# EAGLE design Circuit (EAGLE 5.00)
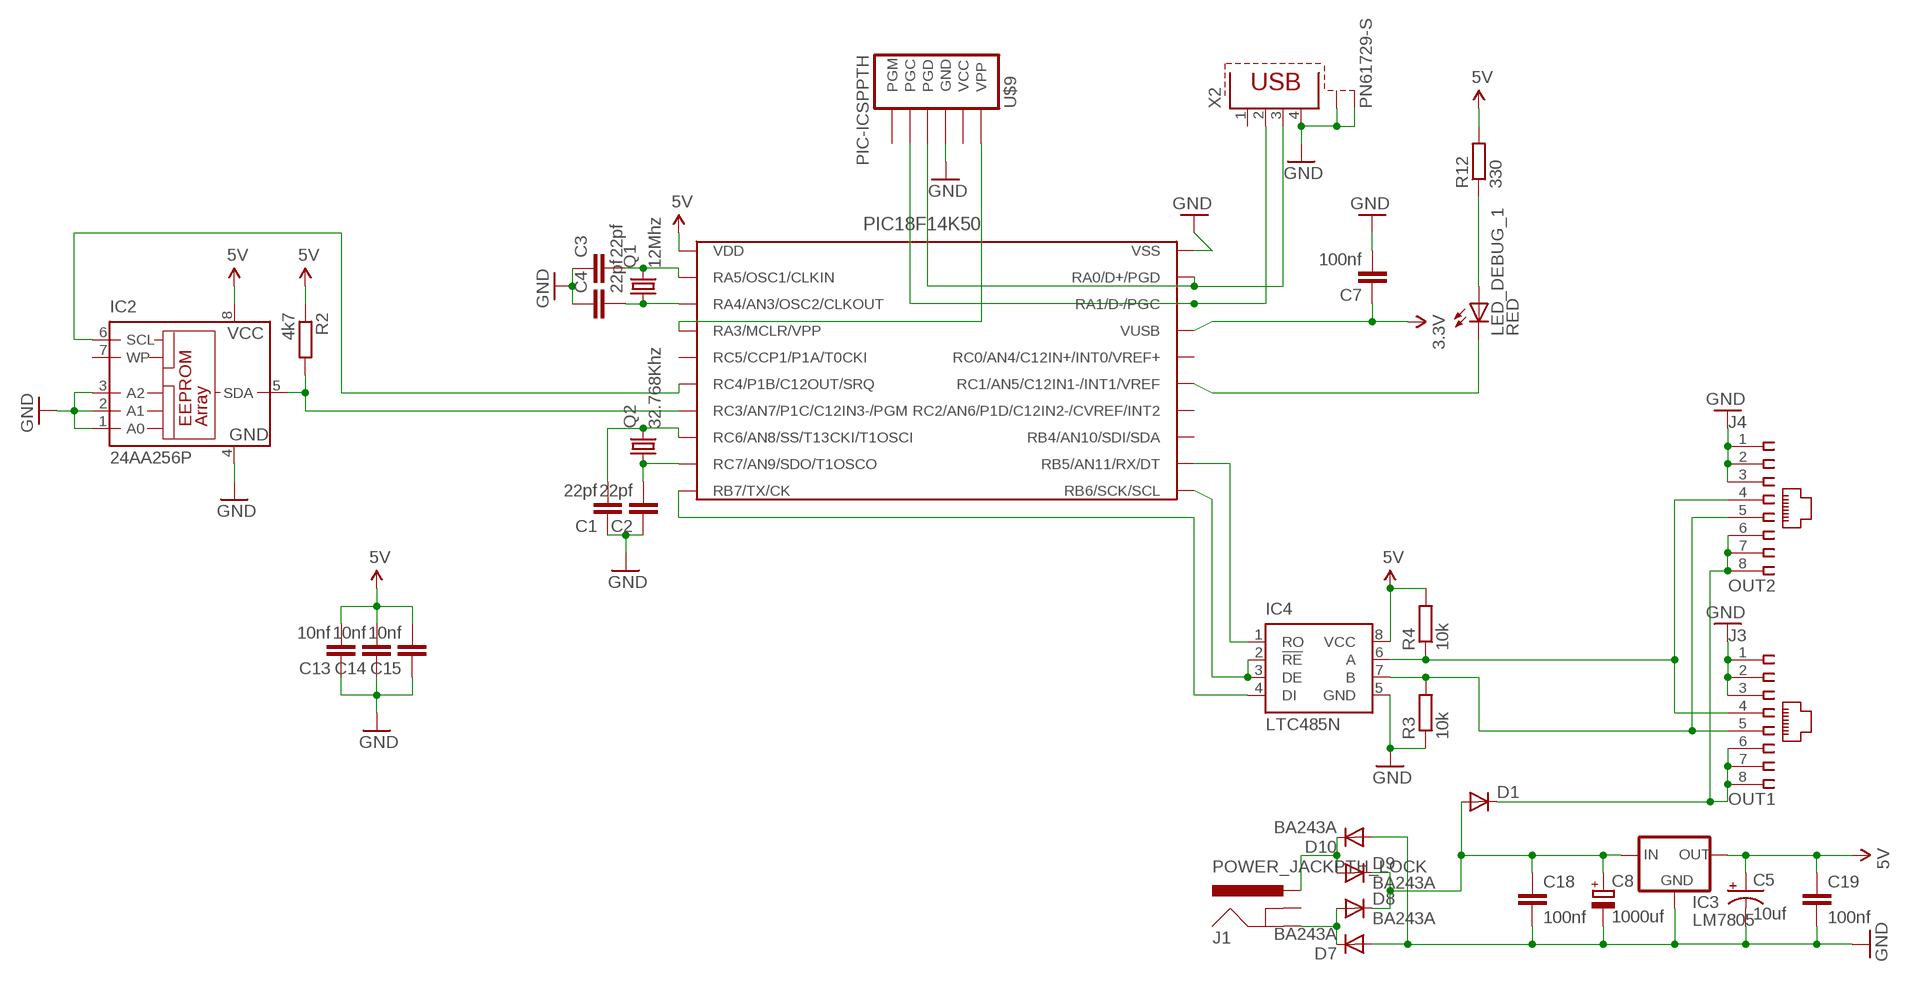
[diagram p0: schematic, sheet 1]

## Parts
C1  22pf  C-EU050-025X075  [C050-025X075]
C2  22pf  C-EU050-025X075  [C050-025X075]
C3  22pf  C-EU050-025X075  [C050-025X075]
C4  22pf  C-EU050-025X075  [C050-025X075]
C5  10uf  CAP_POLPTH1  [CPOL-RADIAL-100UF-25V]
C7  100nf  C2.5/2  [C2.5-2]
C8  1000uf  CPOL-EUE5-10.5  [E5-10,5]
C13  10nf  C-EU050-025X075  [C050-025X075]
C14  10nf  C-EU050-025X075  [C050-025X075]
C15  10nf  C-EU050-025X075  [C050-025X075]
C18  100nf  C-EU050-025X075  [C050-025X075]
C19  100nf  C-EU050-025X075  [C050-025X075]
D1  DIODE-D-7.5  [D-7.5]
D7  BA243A  [DO35-10]
D8  BA243A  [DO35-10]
D9  BA243A  [DO35-10]
D10  BA243A  [DO35-10]
IC2  24AA256P  [DIL8]
IC3  LM7805  78XXS  [78XXS]
IC4  LTC485N  [DIL08]
J1  POWER_JACKPTH_LOCK  [POWER_JACK_PTH_LOCK]
J3  OUT1  215877-4  [215877-4]
J4  OUT2  215877-4  [215877-4]
LED_DEBUG_1  RED  LED3MM  [LED3MM]
Q1  12Mhz  CRYSTALHC49U70  [HC49U70]
Q2  32.768Khz  CRYSTALTC38H  [TC38H]
R2  4k7  R-EU_0204/7  [0204/7]
R3  10k  R-EU_0204/5  [0204/5]
R4  10k  R-EU_0204/5  [0204/5]
R12  330  R-EU_0204/7  [0204/7]
U$1  D.2.18F14K50  [E.18F14K50]
U$9  PIC-ICSPPTH  [MOLEX-1X6]
X2  PN61729-S  [PN61729-S]

## Nets
3.3V: C7.1 U$1.VUSB
5V: C5.1(+) C13.2 C14.2 C15.2 C19.1 IC2.8(VCC) IC3.OUT IC4.8(VCC) R2.1 R4.2 R12.2 U$1.VDD
12V: C8.+ C18.1 D1.A D8.C D9.C IC3.IN
GND: C1.1 C2.1 C3.1 C4.1 C5.2(-) C7.2 C8.- C13.1 C14.1 C15.1 C18.2 C19.2 D7.A D10.A IC2.1(A0) IC2.2(A1) IC2.3(A2) IC2.4(GND) IC3.GND IC4.5(GND) J3.1 J3.2 J3.3 J4.1 J4.2 J4.3 R3.1 U$1.VSS U$9.4(GND) X2.4 X2.S1 X2.S2
N$1: IC2.6(SCL) U$1.RC4/P1B/C12OUT/SRQ
N$4: D7.C D8.A J1.GND
N$5: IC4.1(RO) U$1.RB5/AN11/RX/DT
N$6: IC4.6(A) J3.4 J4.4 R4.1
N$7: IC4.2(!RE) IC4.3(DE) U$1.RB6/SCK/SCL
N$8: D9.A D10.C J1.PWR
N$9: C1.2 Q2.2 U$1.RC6/AN8/SS/T13CKI/T1OSCI
N$10: C2.2 Q2.1 U$1.RC7/AN9/SDO/T1OSCO
N$12: IC2.5(SDA) R2.2 U$1.RC3/AN7/P1C/C12IN3-/PGM
N$13: IC4.7(B) J3.5 J4.5 R3.2
N$14: C4.2 Q1.1 U$1.RA4/AN3/OSC2/CLKOUT
N$15: C3.2 Q1.2 U$1.RA5/OSC1/CLKIN
N$19: D1.C J3.6 J3.7 J3.8 J4.6 J4.7 J4.8
N$28: U$1.RA3/MCLR/VPP U$9.6(VPP)
N$38: U$1.RA0/D+/PGD U$9.3(PGD) X2.3
N$39: U$1.RA1/D-/PGC U$9.2(PGC) X2.2
N$41: IC4.4(DI) U$1.RB7/TX/CK
N$66: LED_DEBUG_1.A R12.1
N$67: LED_DEBUG_1.K(C) U$1.RC1/AN5/C12IN1-/INT1/VREF
Unconnected: IC2.7(WP) J1.GNDBREAK U$1.RB4/AN10/SDI/SDA U$1.RC0/AN4/C12IN+/INT0/VREF+ U$1.RC2/AN6/P1D/C12IN2-/CVREF/INT2 U$1.RC5/CCP1/P1A/T0CKI U$9.1(PGM) U$9.5(VCC) X2.1

## Library data of the parts
C1-C4 C13-C15 C18 C19 = rcl:C-EU: CAPACITOR, European symbol
C5 = SparkFun:CAP_POL: Capacitor Polarized These are standard SMD and PTH capacitors. Normally 10uF, 47uF, and 100uF in electrolytic and tantalum varieties. Always verify the external diameter of the through hole cap, it varies with capacity, voltage, and manufacturer. The EIA devices should be standard.
C7 = capacitor-wima:C: CAPACITOR naming: grid - package width
C8 = rcl:CPOL-EU: POLARIZED CAPACITOR, European symbol
D1 = diode:DIODE-: DIODE
D7-D10 = diode:BA243A: DIODE
IC2 = microchip:24*: Serial EEPROM I2C
IC3 = v-reg:78XXS: VOLTAGE REGULATOR
IC4 = linear-technology:LTC485: Low Power RS485 Interface Transceiver Source: http://www.linear.com/pc/downloadDocument.do?navId=H0,C1,C1007,C1017,P2064,D1718
J1 = SparkFun:POWER_JACK: Power Jack This is the standard 5.5mm barrel jack for power. The PTH is the most common, proven, reliable, footprint. All others are experimental. The Slot footprint only works if the mill layer is transmitted to the PCB fab house so be warned. Spark Fun Electronics SKU : PRT-00119. Mating wall wart : TOL-00298 (and others)
J3 J4 = con-amp:215877-4: AMP connector
LED_DEBUG_1 = SparkFun:LED: LEDs Standard schematic elements and footprints for 5mm, 3mm, 1206, and 0603 sized LEDs. 5mm - Spark Fun Electronics SKU : COM-00529 (and others)
Q1 Q2 = crystal:CRYSTAL: CRYSTAL
R2-R4 = resistor:R-EU_: RESISTOR, European symbol
R12 = rcl:R-EU_: RESISTOR, European symbol
U$1 = pic18f14k50:D.2.18F14K50
U$9 = SparkFun:PIC-ICSP: ISCP Programming connector for UAV, UBW Kit, etc.
X2 = con-berg:PN61729-S: BERG USB connector

## Board
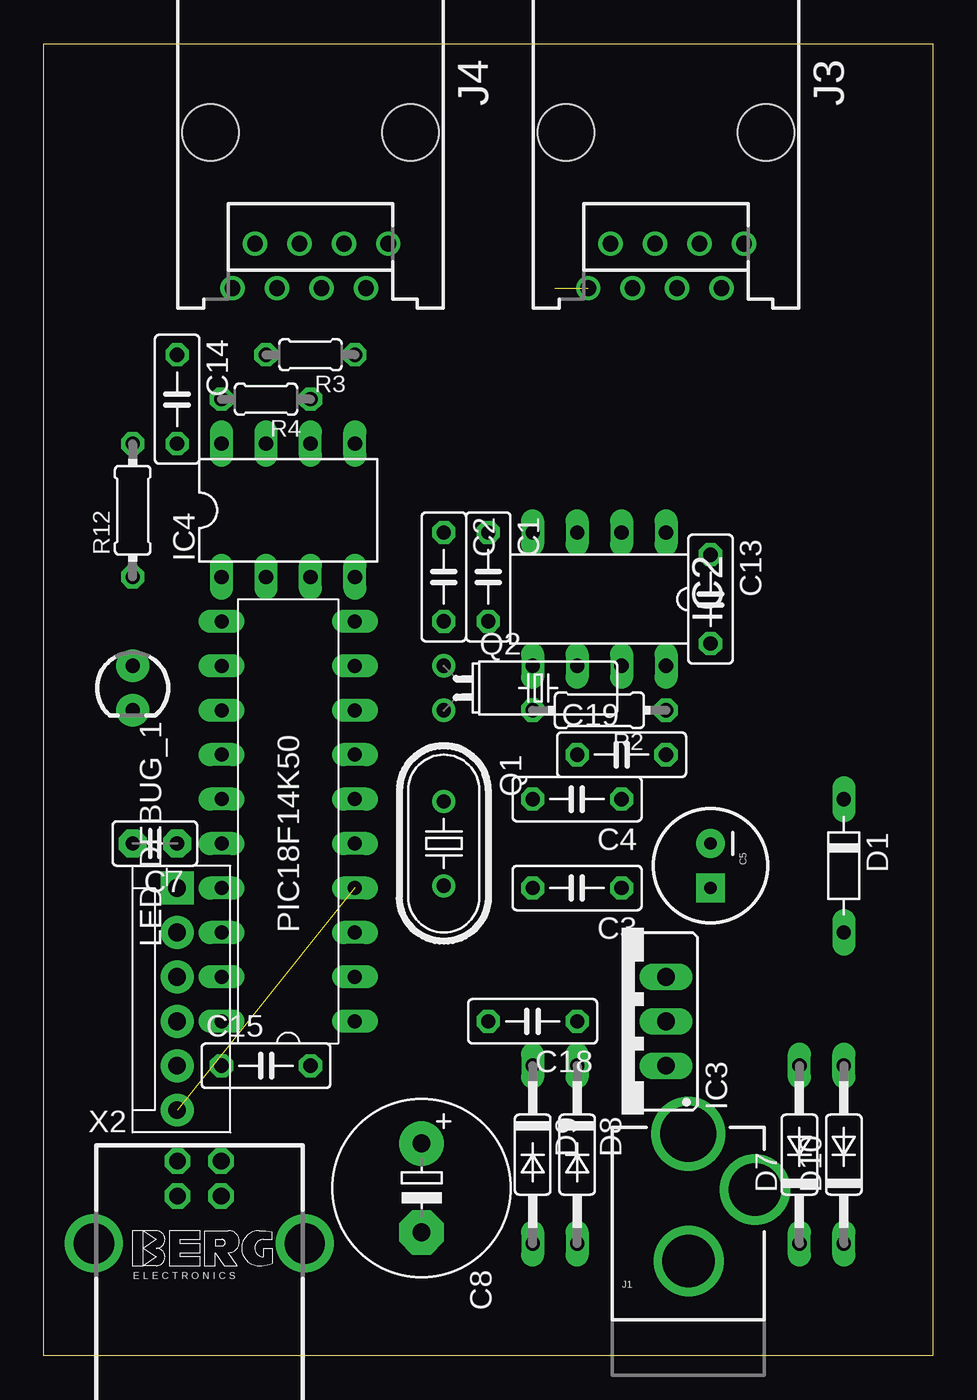
[diagram p1: board, top side]
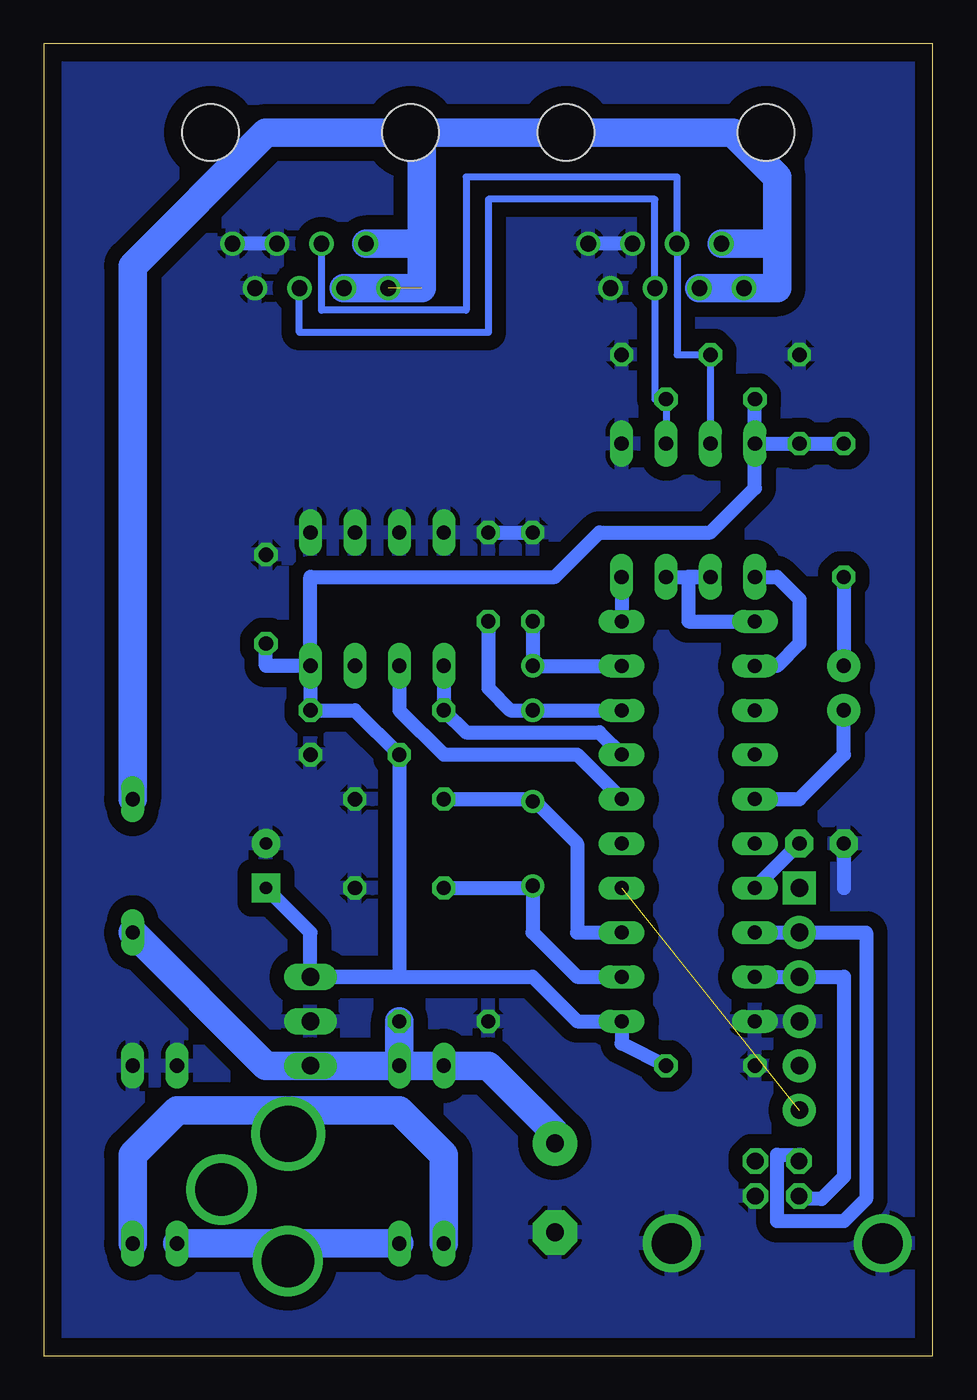
[diagram p2: board, bottom side, seen from below]

Size 50.8 x 75 mm. Coordinates in mm from the lower left corner, seen from the top.
Outline: 50.8,0 0,0 0,75 50.8,75 50.8,0
Copper layers (1*16): Top 0.035mm / dielectric 1.5mm / Bottom 0.035mm
Design rules "default": minimum track width 10mil, minimum drill 24mil, track to track 8mil, track to pad 8mil, pad to pad 8mil, via to via 8mil, smd to smd 8mil, copper to edge 40mil, drill to drill 8mil, minimum pad ring 10mil, minimum via ring 8mil, stop-mask expansion 4mil, vias tented up to drill 0mil, thermal gap 10mil

### Footprints (pad centres in the part's own frame; a part is rotated, then mirrored left to right if it is on the bottom)
C050-025X075 = drill 0.813 octagon: 1 -2.54,0; 2 2.54,0
CPOL-RADIAL-100UF-25V = drill 0.7 pad 1.651 square: 1 1.27,0 | drill 0.7 pad 1.651 round: 2 -1.27,0
C2.5-2 = drill 0.813 pad 1.6 octagon: 1 -1.27,0; 2 1.27,0
E5-10,5 = drill 1.016 pad 2.54 round: + -2.54,0 | drill 1.016 pad 2.54 octagon: - 2.54,0
D-7.5 = drill 0.813 long: A 3.81,0; C -3.81,0
DO35-10 = drill 0.813 long: A 5.08,0; C -5.08,0
DIL8 = drill 0.813 long: 1 -3.81,-3.81; 2 -1.27,-3.81; 3 1.27,-3.81; 4 3.81,-3.81; 5 3.81,3.81; 6 1.27,3.81; 7 -1.27,3.81; 8 -3.81,3.81
78XXS = drill 1.016 long: GND 0,-2.54; IN -2.54,-2.54; OUT 2.54,-2.54
DIL08 = drill 0.813 long: 1 -3.81,-3.81; 2 -1.27,-3.81; 3 1.27,-3.81; 4 3.81,-3.81; 5 3.81,3.81; 6 1.27,3.81; 7 -1.27,3.81; 8 -3.81,3.81
POWER_JACK_PTH_LOCK = drill 2.997 round: GND 0.025,6.608; GNDBREAK 3.812,10.7 | drill 3.2 round: PWR 0,13.878
215877-4 = drill 0.889 round: 1 -4.445,6.35; 2 -3.175,8.89; 3 -1.905,6.35; 4 -0.635,8.89; 5 0.635,6.35; 6 1.905,8.89; 7 3.175,6.35; 8 4.445,8.89 | hole 3.251: -5.715,0; 5.715,0
LED3MM = drill 0.813 pad 1.88 round: A -1.27,0; K 1.27,0
HC49U70 = drill 0.813 round: 1 -2.413,0; 2 2.413,0
TC38H = drill 0.813 round: 1 -1.27,0; 2 1.27,0
0204/7 = drill 0.813 octagon: 1 -3.81,0; 2 3.81,0
0204/5 = drill 0.813 octagon: 1 -2.54,0; 2 2.54,0
E.18F14K50 = drill 0.8 long: RA0/D+/PGD -7.62,3.81; RA1/D-/PGC -5.08,3.81; RA3/MCLR/VPP -2.54,-3.81; RA4/AN3/OSC2/CLKOUT -5.08,-3.81; RA5/OSC1/CLKIN -7.62,-3.81; RB4/AN10/SDI/SDA 7.62,3.81; RB5/AN11/RX/DT 10.16,3.81; RB6/SCK/SCL 12.7,3.81; RB7/TX/CK 12.7,-3.81; RC0/AN4/C12IN+/INT0/VREF+ 0,3.81; RC1/AN5/C12IN1-/INT1/VREF 2.54,3.81; RC2/AN6/P1D/C12IN2-/CVREF/INT2 5.08,3.81; RC3/AN7/P1C/C12IN3-/PGM 5.08,-3.81; RC4/P1B/C12OUT/SRQ 2.54,-3.81; RC5/CCP1/P1A/T0CKI 0,-3.81; RC6/AN8/SS/T13CKI/T1OSCI 7.62,-3.81; RC7/AN9/SDO/T1OSCO 10.16,-3.81; VDD -10.16,-3.81; VSS -10.16,3.81; VUSB -2.54,3.81
MOLEX-1X6 = drill 1.016 pad 1.88 square: 1 0,0 | drill 1.016 pad 1.88 round: 2 2.54,0; 3 5.08,0; 4 7.62,0; 5 10.16,0; 6 12.7,0
PN61729-S = drill 0.95 octagon: 1 1.25,4.71; 2 -1.25,4.71; 3 -1.25,2.71; 4 1.25,2.71 | drill 2.3 pad 2.9 round: S1 -6.02,0; S2 6.02,0

### Placement (x,y rotation side)
C1  25.4,44.52 270 top
C2  22.86,44.52 270 top
C3  30.48,26.74 180 top
C4  30.48,31.82 180 top
C5  38.1,28.01 270 top
C7  6.35,29.28 180 top
C8  21.59,9.59 270 top
C13  38.1,43.25 270 top
C14  7.62,54.68 270 top
C15  12.7,16.58 0 top
C18  27.94,19.12 180 top
C19  33.02,34.36 0 top
D1  45.72,28.01 270 top
D7  43.18,11.5 90 top
D8  30.48,11.5 270 top
D9  27.94,11.5 270 top
D10  45.72,11.5 90 top
IC2  31.75,43.25 180 top
IC3  33.02,19.12 90 top
IC4  13.97,48.33 0 top
J1  36.83,-1.2 0 top
J3  35.56,69.92 180 top
J4  15.24,69.92 180 top
LED_DEBUG_1  5.08,38.17 270 top
Q1  22.86,29.28 270 top
Q2  22.86,38.17 270 top
R2  31.75,36.9 180 top
R3  15.24,57.22 180 top
R4  12.7,54.68 180 top
R12  5.08,48.33 90 top
U$1  13.97,29.28 90 top
U$9  7.62,26.74 270 top
X2  8.89,6.42 0 top

### Tracks (layer width: path | path; a pad name or v marks a point on that pad's centre or on a via)
3.3V
  Bottom 0.813: C7.1 U$1.VUSB
5V
  Bottom 0.813: IC2.8 R2.1 33.02,36.9 C19.1 30.48,21.66 IC3.OUT | R12.2 C14.2 IC4.8 | C15.2 17.78,17.85 U$1.VDD 20.32,19.12 22.86,21.66 IC3.OUT | IC2.8 38.1,39.44 C13.2 | IC4.8 R4.2 | IC4.8 10.16,49.6 12.7,47.06 19.05,47.06 21.59,44.52 35.56,44.52 IC2.8 | IC3.OUT 35.56,24.2 C5.1
12V
  Bottom 1.626: 25.4,16.58 D9.C D8.C | 25.4,16.58 21.59,12.77 C8.+ | D1.A 38.1,16.58 IC3.IN | IC3.IN D8.C | D8.C 25.4,16.58 | D8.C C18.1 | IC3.IN D8.C
GND
  Bottom 0.813: J3.3 J3.1 | J4.3 J4.1 | C1.1 C2.1 | C7.2 5.08,26.74
  pour Bottom (isolate 0.813): 50.8,75 50.8,0.07 0,0.07 0,75
N$1
  Bottom 0.813: IC2.6 30.48,36.9 27.94,34.36 20.32,34.36 U$1.RC4/P1B/C12OUT/SRQ
N$4
  Bottom 1.626: 36.83,6.42 D8.A | D7.C 36.83,6.42 | 36.83,6.42 J1.GND
N$5
  Bottom 0.813: IC4.1 8.89,44.52 7.62,43.25 7.62,40.71 8.89,39.44 U$1.RB5/AN11/RX/DT
N$6
  Bottom 0.406: IC4.6 R4.1 15.88,54.68 J4.4 15.88,66.11 25.4,66.11 25.4,58.49 36.2,58.49 J3.4
N$7
  Bottom 0.813: U$1.RB6/SCK/SCL 13.97,41.98 13.97,44.52 IC4.2 IC4.3
N$8
  Bottom 1.626: 36.83,14.04 30.48,14.04 27.94,11.5 D9.A | 36.83,14.04 J1.PWR | 36.83,14.04 43.18,14.04 45.72,11.5 D10.C
N$9
  Bottom 0.813: C1.2 25.4,38.17 24.13,36.9 Q2.2 U$1.RC6/AN8/SS/T13CKI/T1OSCI
N$10
  Bottom 0.813: C2.2 Q2.1 U$1.RC7/AN9/SDO/T1OSCO
N$12
  Bottom 0.813: U$1.RC3/AN7/P1C/C12IN3-/PGM 19.05,35.63 26.67,35.63 R2.2 IC2.5
N$13
  Bottom 0.406: IC4.7 R3.2 14.61,57.22 J4.5 14.61,67.38 26.67,67.38 26.67,59.76 34.92,59.76 J3.5
N$14
  Bottom 0.813: U$1.RA4/AN3/OSC2/CLKOUT 20.32,24.2 20.32,29.28 22.86,31.82 | 22.86,31.82 Q1.1 | C4.2 22.86,31.82
N$15
  Bottom 0.813: U$1.RA5/OSC1/CLKIN 20.32,21.66 22.86,24.2 Q1.2 22.86,26.74 C3.2
N$19  (1 unrouted)
  Bottom 1.626: J4.6 J4.8 8.89,61.03 | 8.89,61.03 8.89,63.57 J4.7 | J3.6 29.21,61.03 29.21,63.57 | 29.21,63.57 J3.7 | 8.89,61.03 8.89,67.38 11.43,69.92 27.94,69.92 | 27.94,69.92 29.21,69.92 29.21,63.57 | 27.94,69.92 38.1,69.92 45.72,62.3 D1.C
N$28  (1 unrouted)
N$38
  Bottom 0.813: X2.3 7.62,8.96 6.35,8.96 5.08,10.23 5.08,21.66 U$9.3 U$1.RA0/D+/PGD
N$39
  Bottom 0.813: U$9.2 U$1.RA1/D-/PGC U$9.2 | U$9.2 3.81,24.2 3.81,8.96 5.08,7.69 8.89,7.69 8.89,11.5 7.62,11.5 X2.2
N$41
  Bottom 0.813: IC4.4 U$1.RB7/TX/CK
N$66
  Bottom 0.813: R12.1 LED_DEBUG_1.A
N$67
  Bottom 0.813: U$1.RC1/AN5/C12IN1-/INT1/VREF 7.62,31.82 5.08,34.36 LED_DEBUG_1.K